# Altium schematic sheet USB Data isolation.SchDoc: USB Data Isolation
size 431 x 279 mm; DrawnBy: Harsha Sandirigama; Engineer: Harsha Sandirigama; Revision: -; SheetNumber: 3; SheetTotal: 3; Project: USB Isolator; ENG_APP_DATE: --/--/--; DSN_APP_DATE: --/--/--; CHK_APP_DATE: --/--/--
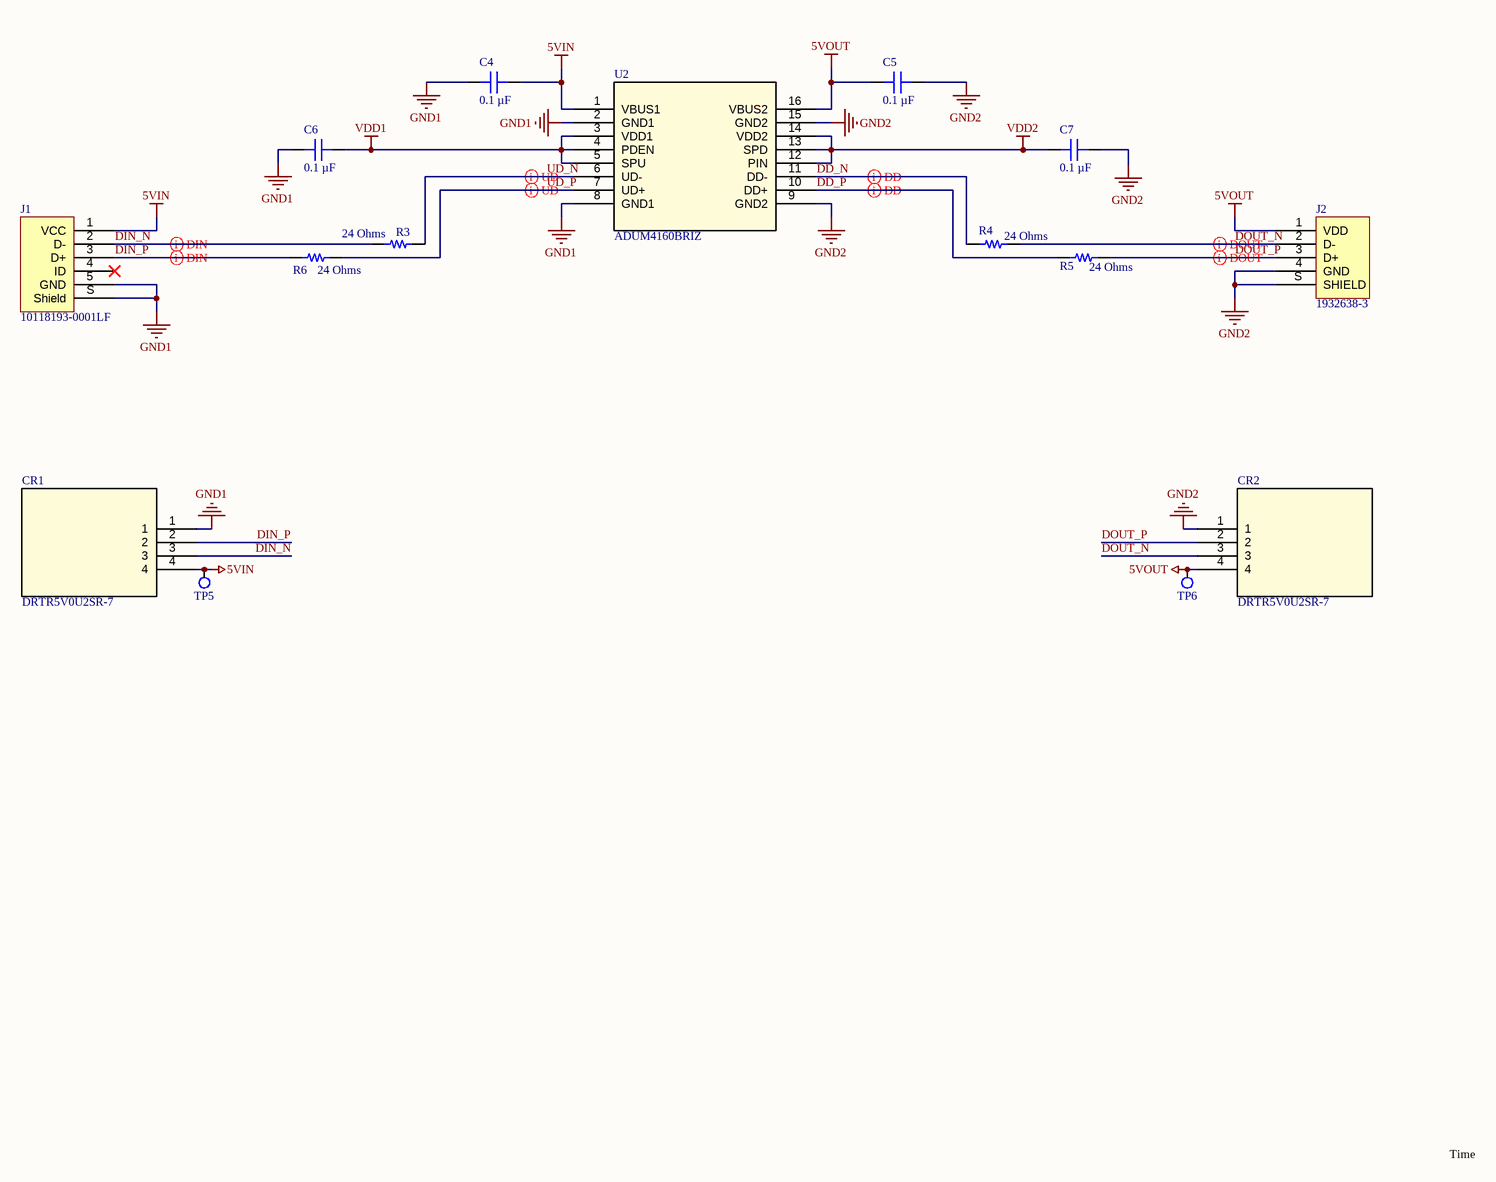
[diagram p0: USB Data isolation.SchDoc]

## Parts
C4  0.1 µF  [CAP 0603_1608]
C5  0.1 µF  [CAP 0603_1608]
C6  0.1 µF  [CAP 0603_1608]
C7  0.1 µF  [CAP 0603_1608]
CR1  DRTR5V0U2SR-7  [SOT143_DIO]
CR2  DRTR5V0U2SR-7  [SOT143_DIO]
J1  10118193-0001LF  [FCI USB 10118193-0001LF]
J2  1932638-3  [TE 1932638-3 USB2.0A]
R3  24 Ohms  [RES 0603_1608]
R4  24 Ohms  [RES 0603_1608]
R5  24 Ohms  [RES 0603_1608]
R6  24 Ohms  [RES 0603_1608]
TP5  Testpoint_1  [Testpoint_1]  (value not drawn)  (no BOM)
TP6  Testpoint_1  [Testpoint_1]  (value not drawn)  (no BOM)
U2  ADUM4160BRIZ  [RI_16_1_ADI]

## Nets
5VIN: C4.1 CR1.4 J1.1(VCC) TP5.1 U2.1(VBUS1)
5VOUT: C5.2 CR2.4 J2.1(VDD) TP6.1 U2.16(VBUS2)
GND1: C4.2 C6.2 CR1.1 J1.5(GND) J1.S(Shield) U2.2(GND1) U2.8(GND1)
GND2: C5.1 C7.1 CR2.1 J2.4(GND) J2.S(SHIELD) U2.9(GND2) U2.15(GND2)
VDD1: C6.1 U2.3(VDD1) U2.4(PDEN) U2.5(SPU)
VDD2: C7.2 U2.12(PIN) U2.13(SPD) U2.14(VDD2)
DD_N: R4.1 U2.11(DD-)
DD_P: R5.1 U2.10(DD+)
DIN_N: CR1.3 J1.2(D-) R3.1
DIN_P: CR1.2 J1.3(D+) R6.1
DOUT_N: CR2.3 J2.2(D-) R4.2
DOUT_P: CR2.2 J2.3(D+) R5.2
UD_N: R3.2 U2.6(UD-)
UD_P: R6.2 U2.7(UD+)

Not connected (* = marked no-connect by the designer): J1 4(ID)*

## Layout directives
differential pair: DD_N, DD_P, DIN_N, DIN_P, DOUT_N, DOUT_P, UD_N, UD_P

## Notes on the sheet
- Time
- DWG. NO.
- REV.
- SHT.
- THIS DOCUMENT AND THE DATA DISCLOSED HEREIN OR HEREWITH IS THE PROPERTY OF ALTIUM LIMITED AND MAY BE FREELY DISTRIBUTED IN WHOLE. NO RIGHTS ARE RESERVED OR EXPRESS OR IMPLIED WARANTEE GIVEN.
- REVISION
- DESCRIPTION
- DATE
- APPROVED
- ENG:
- APPROVALS
- PROJECT
- DSN:
- CHK:
- REFERENCE DOCUMENTS
- PROJECT REVISION:
- TITLE
- DOCUMENT REVISION:
- DESIGN ITEM:
- BOM:
- FAB DWG:
- PCB DWG:
- ASSY DWG:
- SCALE:
- SIZE
- B
- CAGE CODE
- FILE NAME
- DWG NO.
- SHEET
- OF
- REV

## Library data of the parts
C4-C7 = CL10B104KB8NNNL: CAP CER 0.1UF 50V X7R 0603; manufacturer: Samsung Electro-Mechanics; Tolerance: ±10%; Part Number: CL10B104KB8NNNL; Value: 0.1 µF; Applications: General Purpose; Capacitance: 0.1 µF; componentlink1description: Datasheet; componentlink1url: http://www.samsungsem.com/kr/support/product-search/mlcc/CL10B104KB8NNNL.jsp; componentlink2description: DigiKey Link; componentlink2url: https://www.digikey.com/en/products/detail/samsung-electro-mechanics/CL10B104KB8NNNL/3894274; Device Package: 0603 (1608 Metric); lastupdated: 30/03/2022 11:52:00 PM; Lifecycle Status: Active; Minimum Order: 1; Mounting Type: Surface Mount, MLCC; Operating Temperature: -55°C ~ 125°C; Package / Case: 0603 (1608 Metric); packaging: TapeAndReel; partid: 3517; Part Status: Active; price: 0.01; series: CL; Size / Dimension: 0.063" L x 0.031" W (1.60mm x 0.80mm); Supplier 1: DigiKey; Supplier Part Number 1: 1276-CL10B104KB8NNNLCT-ND; Temperature Coefficient: X7R; Thickness (Max): 0.035" (0.90mm); Voltage - Rated: 50V
CR1 CR2 = DRTR5V0U2SR-7: Dual Channel 5.5 V 0.4 W 1 pF Uni-Dirirectional TVS Diode Array - SOT-143; Mfr_Name: Diodes Inc; Manufacturer: Diodes; Type: DEV; Direction: Unidirectional; Number of Bidirectional Channels: 2; Reverse Standoff Voltage: 5.5V; Min Breakdown Voltage: 6V; Power Line Protection: Yes; Peak Pulse Power: 400mW; Test Current: 1mA; Max Reverse Leakage Current: 100nA; Peak Pulse Current: 5A; Copyright: Copyright (C) 2022 Ultra Librarian. All rights reserved.; Manufacturer_Part_Number: DRTR5V0U2SR-7; Digi-Key_Part_Number_1: DRTR5V0U2SR-7DITR-ND; Digi-Key_Part_Number_2: DRTR5V0U2SR-7DICT-ND; Digi-Key_Part_Number_3: DRTR5V0U2SR-7DIDKR-ND; RefDes: RefDes; Supplier 1: Digi-Key; Manufacturer Part Number: DRTR5V0U2SR-7; RoHS: Yes; Category: TVS Diodes; Stock 1: 129137; Pricing 1: 1=0.40000, 10=0.32300, 100=0.22000, 500=0.16500, 1000=0.12375 (USD); Mount: Surface Mount; Case/Package: SOT-143; Number of Pins: 4; Min Operating Temperature: -65°C; Max Operating Temperature: 150°C; Packaging: Tape and Reel; ESD Protection: Yes; Element Configuration: Dual; Length: 3mm; Width: 1.4mm; Height: 1mm; Radiation Hardening: No; RoHS Compliant: Yes; ComponentLink1URL: https://datasheet.ciiva.com/29588/drtr5v0u2sr-29588600.pdf?src-supplier=Digi-Key; ComponentLink1Description: https://datasheet.ciiva.com/29588/drtr5v0u2sr-29588600.pdf?src-supplier=Digi-Key; ComponentLink2URL: https://datasheet.ciiva.com/48480/drtr5v0u2sr-48480031.pdf?src-supplier=Avnet; ComponentLink2Description: https://datasheet.ciiva.com/48480/drtr5v0u2sr-48480031.pdf?src-supplier=Avnet; ComponentLink3URL: https://datasheet.ciiva.com/29588/drtr5v0u2sr-29588602.pdf?src-supplier=Digi-Key; ComponentLink3Description: https://datasheet.ciiva.com/29588/drtr5v0u2sr-29588602.pdf?src-supplier=Digi-Key; Supplier Part Number 1: DRTR5V0U2SR-7DICT-ND
J1 = 10118193-0001LF: CONN RCPT USB2.0 MICRO B SMD R/A; Manufacturer: Amphenol ICC (FCI); Connector Type: USB - micro B; Current Rating (Amps): 1.8A per Contact; Gender: Receptacle; Mating Cycles: 10000; Number of Contacts: 5; Number of Ports: 1; Shielding: Shielded; Voltage - Rated: 100VAC; Part Number: 10118193-0001LF; ComponentLink1Description: Datasheet; ComponentLink1URL: https://cdn.amphenol-icc.com/media/wysiwyg/files/documentation/datasheet/inputoutput/io_usb_micro.pdf; ComponentLink2Description: DigiKey Link; ComponentLink2URL: //digikey.com/product-detail/en/amphenol-icc-fci/10118193-0001LF/609-4616-2-ND/2785388; Features: Solder Retention; LastUpdated: 9/12/2019 8:51:28 PM; Lifecycle Status: 0; Minimum Order: 1; Mounting Feature: Horizontal; Mounting Type: Surface Mount, Right Angle; Through Hole; Operating Temperature: -30°C ~ 80°C; Packaging: TapeAndReel; Part Status: Active; Price: 0.21; Series: -; Specifications: USB 2.0; Supplier 1: DigiKey; Supplier Part Number 1: 609-4616-2-ND; Termination: Solder
J2 = 1932638-3: CONN RCPT USB2.0 TYPEA 4P SMD RA; Manufacturer: TE Connectivity AMP Connectors; Connector Type: USB - A; Current Rating (Amps): 1A per Contact; Gender: Receptacle; Mating Cycles: 1500; Number of Contacts: 4; Number of Ports: 1; Shielding: Shielded; Voltage - Rated: 30VAC; Part Number: 1932638-3; ComponentLink1Description: Datasheet; ComponentLink1URL: https://www.te.com/commerce/DocumentDelivery/DDEController?Action=srchrtrv&DocNm=501-60007-1&DocType=SS&DocLang=EN; ComponentLink2Description: DigiKey Link; ComponentLink2URL: //digikey.com/product-detail/en/te-connectivity-amp-connectors/1932638-3/A117902TR-ND/4731612; Features: Solder Retention; LastUpdated: 9/12/2019 8:47:08 PM; Lifecycle Status: 0; Minimum Order: 1; Mounting Feature: Horizontal; Mounting Type: Surface Mount, Right Angle; Operating Temperature: -55°C ~ 85°C; Packaging: TapeAndReel; Part Status: Active; Price: 0.97; Series: -; Specifications: USB 2.0; Supplier 1: DigiKey; Supplier Part Number 1: A117902TR-ND; Termination: Solder
R3-R6 = CPF0603B24RE1: RES SMD 24 OHM 0.1% 1/16W 0603; Manufacturer: TE Connectivity Passive Product; Power (Watts): 0.063W, 1/16W; Temperature Coefficient: ±25ppm/°C; Part Number: CPF0603B24RE1; Value: 24 Ohms; ComponentLink1Description: Datasheet; ComponentLink1URL: https://www.te.com/commerce/DocumentDelivery/DDEController?Action=srchrtrv&DocNm=1773200&DocType=DS&DocLang=English; ComponentLink2Description: DigiKey Link; ComponentLink2URL: https://www.digikey.com/en/products/detail/te-connectivity-passive-product/CPF0603B24RE1/2381882; Composition: Thin Film; Device Package: 0603 (1608 Metric); Height - Seated (Max): 0.022" (0.55mm); LastUpdated: 31/03/2022 9:04:55 AM; Lifecycle Status: Active; Minimum Order: 1; Number of Terminations: 2; Operating Temperature: -55°C ~ 155°C; Package / Case: 0603 (1608 Metric); Packaging: TapeAndReel; PartId: 5768; Part Status: Active; Price: 0.13; Resistance: 24 Ohms; Series: CPF, Neohm; Size / Dimension: 0.061" L x 0.031" W (1.55mm x 0.80mm); Supplier 1: DigiKey; Supplier Part Number 1: A103071CT-ND; Supplier Device Package: 0603; Tolerance: ±0.1%
TP5 TP6 = Testpoint_1: Testpoint
U2 = ADUM4160BRIZ: USB Digital Isolator 5000Vrms 1 Channel 12Mbps 25kV/µs CMTI 16-SOIC (0.295", 7.50mm Width); Mfr_Name: Analog Devices Inc; Copyright: Copyright (C) 2022 Ultra Librarian. All rights reserved.; Manufacturer_Part_Number: ADUM4160BRIZ; RefDes: RefDes; Type: DEV